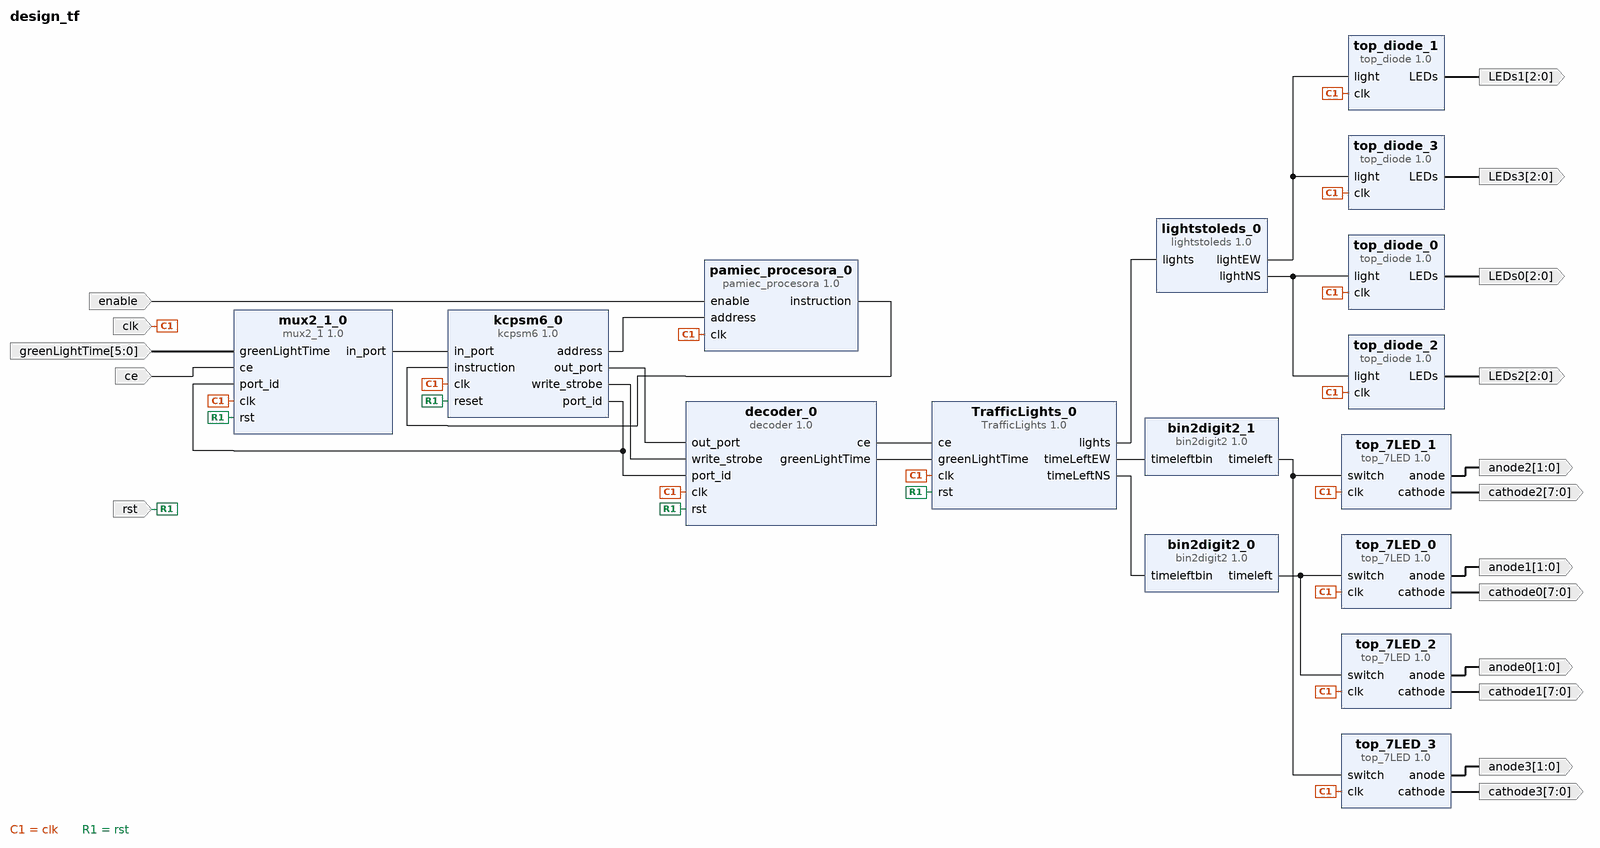
[diagram p0: block diagram of the top level]
# Vivado block design design_tf, xc7z020clg400-3, Vivado 2019.2
create_bd_design design_tf

create_bd_port -dir I -type clk clk
set_property -dict {CONFIG.FREQ_HZ 100000000} [get_bd_ports clk]
create_bd_port -dir O -from 2 -to 0 LEDs0
create_bd_port -dir O -from 2 -to 0 LEDs1
create_bd_port -dir O -from 2 -to 0 LEDs2
create_bd_port -dir O -from 2 -to 0 LEDs3
create_bd_port -dir O -from 7 -to 0 cathode0
create_bd_port -dir O -from 1 -to 0 anode0
create_bd_port -dir O -from 7 -to 0 cathode1
create_bd_port -dir O -from 7 -to 0 cathode2
create_bd_port -dir O -from 7 -to 0 cathode3
create_bd_port -dir O -from 1 -to 0 anode1
create_bd_port -dir O -from 1 -to 0 anode2
create_bd_port -dir O -from 1 -to 0 anode3
create_bd_port -dir I -type rst rst
set_property -dict {CONFIG.POLARITY ACTIVE_HIGH} [get_bd_ports rst]
create_bd_port -dir I ce
create_bd_port -dir I -from 5 -to 0 greenLightTime
create_bd_port -dir I enable

create_bd_cell -type ip -vlnv xilinx.com:user:TrafficLights:1.0 TrafficLights_0
create_bd_cell -type ip -vlnv xilinx.com:user:top_diode:1.0 top_diode_0
create_bd_cell -type ip -vlnv xilinx.com:user:top_diode:1.0 top_diode_1
create_bd_cell -type ip -vlnv xilinx.com:user:top_diode:1.0 top_diode_2
create_bd_cell -type ip -vlnv xilinx.com:user:top_diode:1.0 top_diode_3
create_bd_cell -type ip -vlnv xilinx.com:user:bin2digit2:1.0 bin2digit2_0
create_bd_cell -type ip -vlnv xilinx.com:user:bin2digit2:1.0 bin2digit2_1
create_bd_cell -type ip -vlnv xilinx.com:user:lightstoleds:1.0 lightstoleds_0
create_bd_cell -type ip -vlnv xilinx.com:user:kcpsm6:1.0 kcpsm6_0
create_bd_cell -type ip -vlnv xilinx.com:user:decoder:1.0 decoder_0
create_bd_cell -type ip -vlnv xilinx.com:user:mux2_1:1.0 mux2_1_0
create_bd_cell -type ip -vlnv xilinx.com:user:pamiec_procesora:1.0 pamiec_procesora_0
create_bd_cell -type ip -vlnv xilinx.com:user:top_7LED:1.0 top_7LED_0
create_bd_cell -type ip -vlnv xilinx.com:user:top_7LED:1.0 top_7LED_1
create_bd_cell -type ip -vlnv xilinx.com:user:top_7LED:1.0 top_7LED_2
create_bd_cell -type ip -vlnv xilinx.com:user:top_7LED:1.0 top_7LED_3

# ---- connections ----

connect_bd_net [get_bd_ports clk] \
  [get_bd_pins TrafficLights_0/clk] [get_bd_pins top_diode_0/clk] [get_bd_pins top_diode_1/clk] [get_bd_pins top_diode_2/clk] \
  [get_bd_pins top_diode_3/clk] [get_bd_pins kcpsm6_0/clk] [get_bd_pins mux2_1_0/clk] [get_bd_pins pamiec_procesora_0/clk] \
  [get_bd_pins decoder_0/clk] [get_bd_pins top_7LED_3/clk] [get_bd_pins top_7LED_2/clk] [get_bd_pins top_7LED_0/clk] \
  [get_bd_pins top_7LED_1/clk]
connect_bd_net [get_bd_pins top_diode_0/LEDs] [get_bd_ports LEDs0]
connect_bd_net [get_bd_pins top_diode_1/LEDs] [get_bd_ports LEDs1]
connect_bd_net [get_bd_pins top_diode_2/LEDs] [get_bd_ports LEDs2]
connect_bd_net [get_bd_pins top_diode_3/LEDs] [get_bd_ports LEDs3]
connect_bd_net [get_bd_pins TrafficLights_0/timeLeftNS] [get_bd_pins bin2digit2_0/timeleftbin]
connect_bd_net [get_bd_pins TrafficLights_0/timeLeftEW] [get_bd_pins bin2digit2_1/timeleftbin]
connect_bd_net [get_bd_pins TrafficLights_0/lights] [get_bd_pins lightstoleds_0/lights]
connect_bd_net [get_bd_pins lightstoleds_0/lightNS] [get_bd_pins top_diode_0/light] [get_bd_pins top_diode_2/light]
connect_bd_net [get_bd_pins lightstoleds_0/lightEW] [get_bd_pins top_diode_1/light] [get_bd_pins top_diode_3/light]
connect_bd_net [get_bd_ports rst] \
  [get_bd_pins TrafficLights_0/rst] [get_bd_pins kcpsm6_0/reset] [get_bd_pins mux2_1_0/rst] [get_bd_pins decoder_0/rst]
connect_bd_net [get_bd_pins decoder_0/ce] [get_bd_pins TrafficLights_0/ce]
connect_bd_net [get_bd_pins decoder_0/greenLightTime] [get_bd_pins TrafficLights_0/greenLightTime]
connect_bd_net [get_bd_pins kcpsm6_0/address] [get_bd_pins pamiec_procesora_0/address]
connect_bd_net [get_bd_pins pamiec_procesora_0/instruction] [get_bd_pins kcpsm6_0/instruction]
connect_bd_net [get_bd_pins mux2_1_0/in_port] [get_bd_pins kcpsm6_0/in_port]
connect_bd_net [get_bd_pins kcpsm6_0/port_id] [get_bd_pins mux2_1_0/port_id] [get_bd_pins decoder_0/port_id]
connect_bd_net [get_bd_pins kcpsm6_0/out_port] [get_bd_pins decoder_0/out_port]
connect_bd_net [get_bd_pins kcpsm6_0/write_strobe] [get_bd_pins decoder_0/write_strobe]
connect_bd_net [get_bd_ports greenLightTime] [get_bd_pins mux2_1_0/greenLightTime]
connect_bd_net [get_bd_ports ce] [get_bd_pins mux2_1_0/ce]
connect_bd_net [get_bd_pins top_7LED_0/cathode] [get_bd_ports cathode0]
connect_bd_net [get_bd_pins top_7LED_0/anode] [get_bd_ports anode1]
connect_bd_net [get_bd_pins top_7LED_1/cathode] [get_bd_ports cathode2]
connect_bd_net [get_bd_pins top_7LED_1/anode] [get_bd_ports anode2]
connect_bd_net [get_bd_pins top_7LED_2/cathode] [get_bd_ports cathode1]
connect_bd_net [get_bd_pins top_7LED_2/anode] [get_bd_ports anode0]
connect_bd_net [get_bd_pins top_7LED_3/cathode] [get_bd_ports cathode3]
connect_bd_net [get_bd_pins top_7LED_3/anode] [get_bd_ports anode3]
connect_bd_net [get_bd_pins bin2digit2_0/timeleft] [get_bd_pins top_7LED_0/switch] [get_bd_pins top_7LED_2/switch]
connect_bd_net [get_bd_pins bin2digit2_1/timeleft] [get_bd_pins top_7LED_3/switch] [get_bd_pins top_7LED_1/switch]
connect_bd_net [get_bd_ports enable] [get_bd_pins pamiec_procesora_0/enable]

validate_bd_design
save_bd_design
